# EAGLE schematic 25mm battery board (EAGLE 6.2)
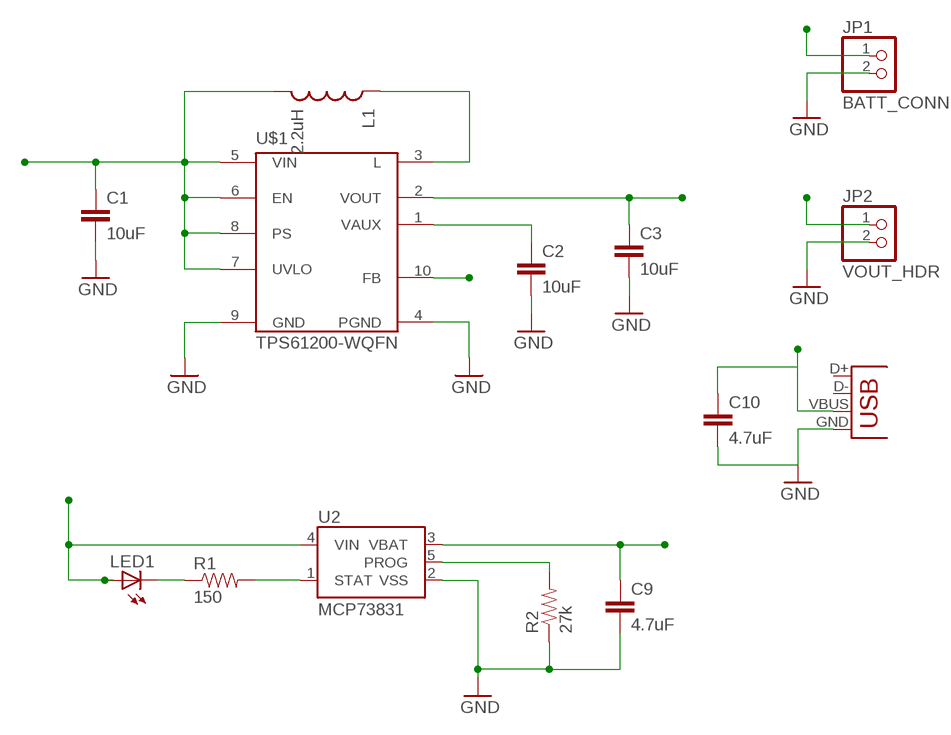
[diagram p0: schematic, sheet 1]

## Parts
C1  10uF  CAP1206  [1206]
C2  10uF  CAP1206  [1206]
C3  10uF  CAP1206  [1206]
C9  4.7uF  CAP1206  [1206]
C10  4.7uF  CAP1206  [1206]
JP1  BATT_CONN  PINHD-1X2  [1X02]
JP2  VOUT_HDR  PINHD-1X2  [1X02]
L1  2.2uH  INDUCTOR-  [CDRH3D28]
LED1  LED0603  [LED-0603]
R1  150  RESISTOR0805-RES  [0805]
R2  27k  RESISTOR0805-RES  [0805]
U2  MCP73831  [SOT23-5]
U$1  TPS61200-WQFN  [QFN-10]
X1  USBSMD  [USB-MINIB]

## Nets
GND: C1.2 C2.2 C3.2 C9.2 C10.2 JP1.2 JP2.2 R2.1 U2.2(VSS) U$1.4(PGND) U$1.9(GND) X1.GND
N$1: R1.2 U2.1(STAT)
N$2: L1.1 U$1.3(L)
N$3: LED1.C R1.1
N$4: C2.1 U$1.1(VAUX)
N$6: R2.2 U2.5(PROG)
VBATT: C1.1 C9.1 JP1.1 L1.2 U2.3(VBAT) U$1.5(VIN) U$1.6(EN) U$1.7(UVLO) U$1.8(PS)
VOUT: C3.1 JP2.1 U$1.2(VOUT) U$1.10(FB)
VUSB: C10.1 LED1.A U2.4(VIN) X1.VBUS
Unconnected: X1.D+ X1.D-

## Library data of the parts
C1-C3 C9 C10 = SparkFun:CAP: Capacitor Standard 0603 ceramic capacitor, and 0.1" leaded capacitor.
JP1 JP2 = pinhead:PINHD-1X2: PIN HEADER
L1 = SparkFun:INDUCTOR: Inductors Basic Inductor/Choke - 0603 and 1206. Footprints are not proven and vary greatly between part numbers.
LED1 = SparkFun:LED: LEDs Standard schematic elements and footprints for 5mm, 3mm, 1206, and 0603 sized LEDs. 5mm - Spark Fun Electronics SKU : COM-00529 (and others)
R1 R2 = SparkFun:RESISTOR: Resistor Basic schematic elements and footprints for 0603, 1206, and PTH resistors.
U2 = SparkFun:MCP73831: Microchip's MCP73831 Miniature single cell, fully integrated Li-Ion, Li-polymer charge management controller http://ww1.microchip.com/downloads/en/DeviceDoc/21984a.pdf
U$1 = Synapseware:TPS61200
X1 = SparkFun:USB: USB Connectors USB-B-PTH is fully proven SKU : PRT-00139 USB-miniB is fully proven SKU : PRT-00587 USB-A-PCB is untested. USB-A-H is throughly reviewed, but untested. Spark Fun Electronics SKU : PRT-00437 USB-B-SMT is throughly reviewed, but untested. Needs silkscreen touching up. USB-A-S has not been used/tested USB-MB-H has not been used/tested